# EAGLE schematic Schema (EAGLE 9.6.2)
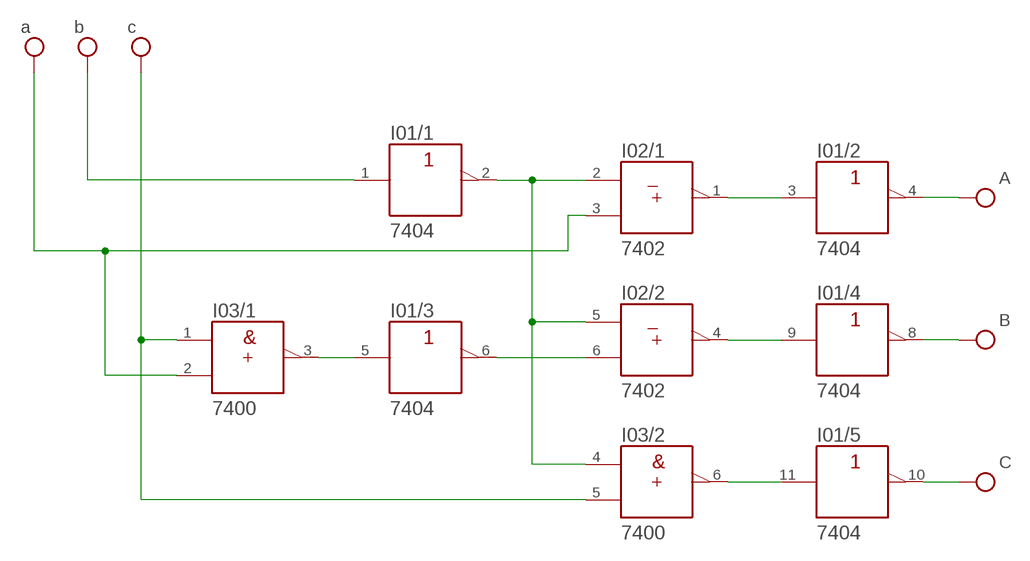
[diagram p0: schematic, sheet 1]

## Parts
I01  7404  7404N  [DIL14]
I02  7402  7402N  [DIL14]
I03  7400  7400N  [DIL14]

## Nets
N$1: I01.2(/1:Y) I02.2(/1:A) I02.5(/2:A) I03.4(/2:A)
N$2: I01.3(/2:A) I02.1(/1:Y)
N$3: I01.9(/4:A) I02.4(/2:Y)
N$4: I01.11(/5:A) I03.6(/2:Y)
N$6: I01.5(/3:A) I03.3(/1:Y)
N$7: I01.6(/3:Y) I02.6(/2:B)
VCC: I01.1(/1:A) I01.4(/2:Y) I01.8(/4:Y) I01.10(/5:Y) I02.3(/1:B) I03.1(/1:A) I03.2(/1:B) I03.5(/2:B) ; supply symbol labelled c, b, a, A, B, C
Unconnected: I01.12(/6:Y) I01.13(/6:A) I02.8(/3:A) I02.9(/3:B) I02.10(/3:Y) I02.11(/4:A) I02.12(/4:B) I02.13(/4:Y) I03.8(/3:Y) I03.9(/3:A) I03.10(/3:B) I03.11(/4:Y) I03.12(/4:A) I03.13(/4:B)

## Power pins joined to a net without a drawn wire
+UB: I01.14(/+UB:+UB) I02.14(/+UB:+UB) I03.14(/+UB:+UB)
-UB: I01.7(/-UB:-UB) I02.7(/-UB:-UB) I03.7(/-UB:-UB)

## Library data of the parts
I01 = 74ttl-din:74*04: Hex INVERTER
I02 = 74ttl-din:74*02: Quad 2-input NOR gate
I03 = 74ttl-din:74*00: Quad 2-input NAND gate